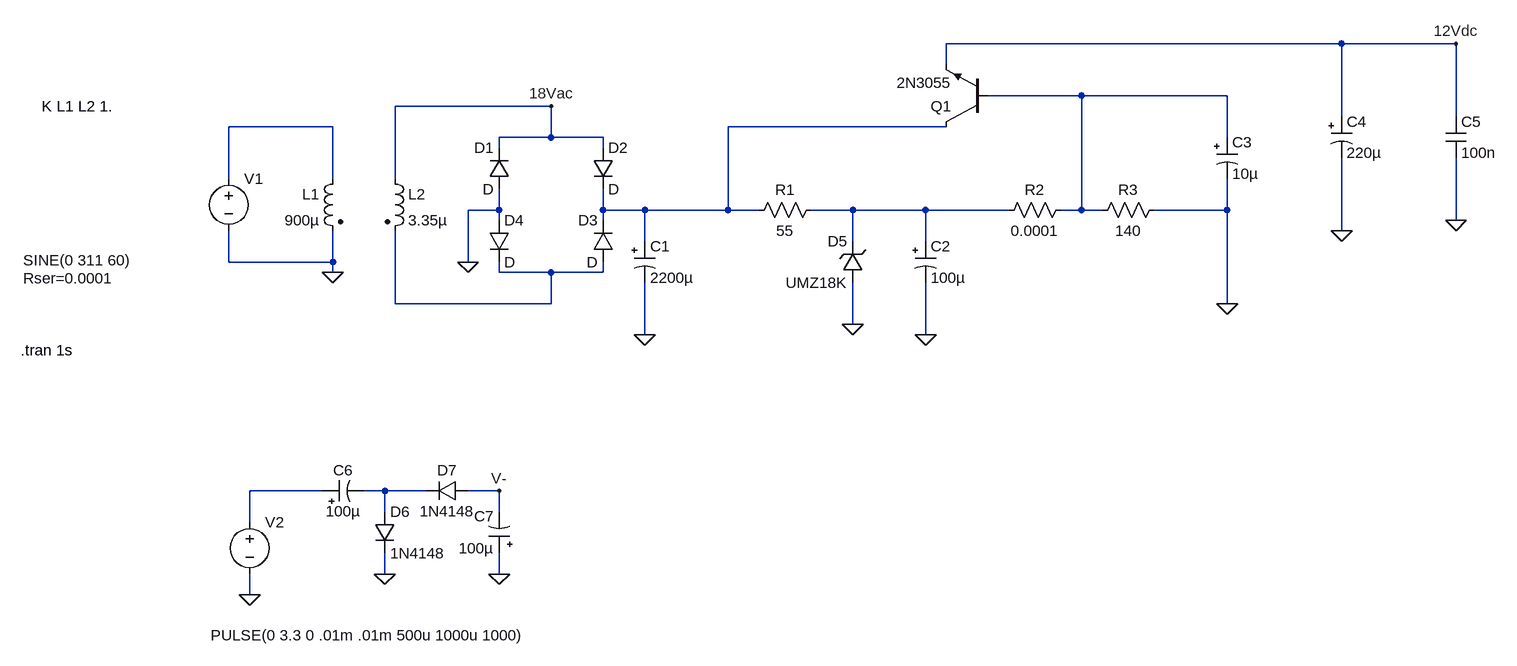
[diagram p0: schematic Draft1.asc]
Draft1.asc, the LTspice schematic file:
Version 4
SHEET 1 1064 800
WIRE 816 -128 208 -128
WIRE 992 -128 816 -128
WIRE 208 -96 208 -128
WIRE 416 -48 272 -48
WIRE 640 -48 416 -48
WIRE -400 -32 -640 -32
WIRE 816 -16 816 -128
WIRE 992 -16 992 -128
WIRE -736 0 -896 0
WIRE 208 0 -128 0
WIRE -400 16 -400 -32
WIRE -400 16 -480 16
WIRE -320 16 -400 16
WIRE 640 16 640 -48
WIRE -480 32 -480 16
WIRE -320 32 -320 16
WIRE -896 80 -896 0
WIRE -736 80 -736 0
WIRE -640 80 -640 -32
WIRE -480 128 -480 96
WIRE -480 128 -528 128
WIRE -320 128 -320 96
WIRE -256 128 -320 128
WIRE -128 128 -128 0
WIRE -128 128 -256 128
WIRE -80 128 -128 128
WIRE 64 128 0 128
WIRE 176 128 64 128
WIRE 304 128 176 128
WIRE 416 128 416 -48
WIRE 416 128 384 128
WIRE 448 128 416 128
WIRE 640 128 640 80
WIRE 640 128 528 128
WIRE -480 144 -480 128
WIRE -320 144 -320 128
WIRE 992 144 992 48
WIRE 816 160 816 48
WIRE -256 176 -256 128
WIRE 64 176 64 128
WIRE 176 176 176 128
WIRE -896 208 -896 160
WIRE -736 208 -736 160
WIRE -736 208 -896 208
WIRE -528 208 -528 128
WIRE -736 224 -736 208
WIRE -480 224 -480 208
WIRE -400 224 -480 224
WIRE -320 224 -320 208
WIRE -320 224 -400 224
WIRE -640 272 -640 160
WIRE -400 272 -400 224
WIRE -400 272 -640 272
WIRE 640 272 640 128
WIRE 64 304 64 240
WIRE -256 320 -256 240
WIRE 176 320 176 240
WIRE -752 560 -864 560
WIRE -656 560 -688 560
WIRE -592 560 -656 560
WIRE -480 560 -528 560
WIRE -656 592 -656 560
WIRE -480 592 -480 560
WIRE -864 608 -864 560
WIRE -656 688 -656 656
WIRE -480 688 -480 656
WIRE -864 720 -864 688
FLAG -736 224 0
FLAG -256 320 0
FLAG -528 208 0
FLAG -400 -32 18Vac
FLAG 64 304 0
FLAG 176 320 0
FLAG 640 272 0
FLAG 816 160 0
FLAG 992 144 0
FLAG 992 -128 12Vdc
FLAG -864 720 0
FLAG -656 688 0
FLAG -480 688 0
FLAG -480 560 V-
SYMBOL voltage -896 64 R0
WINDOW 3 -316 141 Left 2
WINDOW 123 0 0 Left 0
WINDOW 39 -316 169 Left 2
SYMATTR Value SINE(0 311 60)
SYMATTR SpiceLine Rser=0.0001
SYMATTR InstName V1
SYMBOL ind2 -720 64 M0
SYMATTR InstName L1
SYMATTR Value 900µ
SYMBOL ind2 -656 64 R0
SYMATTR InstName L2
SYMATTR Value 3.35µ
SYMBOL diode -464 96 R180
WINDOW 0 24 64 Left 2
WINDOW 3 24 0 Left 2
SYMATTR InstName D1
SYMBOL diode -336 32 R0
SYMATTR InstName D2
SYMBOL diode -304 208 R180
WINDOW 0 24 64 Left 2
WINDOW 3 24 0 Left 2
SYMATTR InstName D3
SYMBOL diode -496 144 R0
SYMATTR InstName D4
SYMBOL polcap -272 176 R0
SYMATTR InstName C1
SYMATTR Value 2200µ
SYMATTR SpiceLine V=25
SYMBOL npn 272 0 R180
SYMATTR InstName Q1
SYMATTR Value 2N3055
SYMBOL res 16 112 R90
WINDOW 0 0 56 VBottom 2
WINDOW 3 32 56 VTop 2
SYMATTR InstName R1
SYMATTR Value 55
SYMBOL zener 80 240 R180
WINDOW 0 24 64 Left 2
WINDOW 3 24 0 Left 2
SYMATTR InstName D5
SYMATTR Value UMZ18K
SYMATTR Description Diode
SYMATTR Type diode
SYMBOL polcap 160 176 R0
SYMATTR InstName C2
SYMATTR Value 100µ
SYMATTR SpiceLine V=25
SYMBOL res 400 112 R90
WINDOW 0 0 56 VBottom 2
WINDOW 3 32 56 VTop 2
SYMATTR InstName R2
SYMATTR Value 0.0001
SYMBOL res 544 112 R90
WINDOW 0 0 56 VBottom 2
WINDOW 3 32 56 VTop 2
SYMATTR InstName R3
SYMATTR Value 140
SYMBOL polcap 624 16 R0
SYMATTR InstName C3
SYMATTR Value 10µ
SYMATTR SpiceLine V=25
SYMBOL polcap 800 -16 R0
SYMATTR InstName C4
SYMATTR Value 220µ
SYMATTR SpiceLine V=25
SYMBOL cap 976 -16 R0
SYMATTR InstName C5
SYMATTR Value 100n
SYMBOL voltage -864 592 R0
WINDOW 3 -60 190 Left 2
WINDOW 123 0 0 Left 0
WINDOW 39 0 0 Left 0
SYMATTR Value PULSE(0 3.3 0 .01m .01m 500u 1000u 1000)
SYMATTR InstName V2
SYMBOL polcap -752 576 R270
WINDOW 0 32 32 VTop 2
WINDOW 3 0 32 VBottom 2
SYMATTR InstName C6
SYMATTR Value 100µ
SYMATTR SpiceLine V=16
SYMBOL diode -672 592 R0
SYMATTR InstName D6
SYMATTR Value 1N4148
SYMBOL diode -528 544 R90
WINDOW 0 0 32 VBottom 2
WINDOW 3 32 32 VTop 2
SYMATTR InstName D7
SYMATTR Value 1N4148
SYMBOL polcap -464 656 R180
WINDOW 0 24 57 Left 2
WINDOW 3 24 8 Left 2
SYMATTR InstName C7
SYMATTR Value 100µ
SYMATTR SpiceLine V=16
TEXT -1184 -32 Left 2 !K L1 L2 1.
TEXT -1216 344 Left 2 !.tran 1s

The netlist it stands for:
* Draft1.asc
V1 N002 0 SINE(0 311 60) Rser=0.0001
L1 N002 0 900µ
L2 18Vac N005 3.35µ
D1 0 18Vac D
D2 18Vac N003 D
D3 N005 N003 D
D4 0 N005 D
C1 N003 0 2200µ V=25
Q1 N003 N001 12Vdc 0 2N3055
R1 N004 N003 55
D5 0 N004 UMZ18K
C2 N004 0 100µ V=25
R2 N001 N004 0.0001
R3 0 N001 140
C3 N001 0 10µ V=25
C4 12Vdc 0 220µ V=25
C5 12Vdc 0 100n
V2 N006 0 PULSE(0 3.3 0 .01m .01m 500u 1000u 1000)
C6 N006 N007 100µ V=16
D6 N007 0 1N4148
D7 V- N007 1N4148
C7 0 V- 100µ V=16
.model D D
.lib standard.dio
.model NPN NPN
.model PNP PNP
.lib standard.bjt
K L1 L2 1.
.tran 1s
.backanno
.end